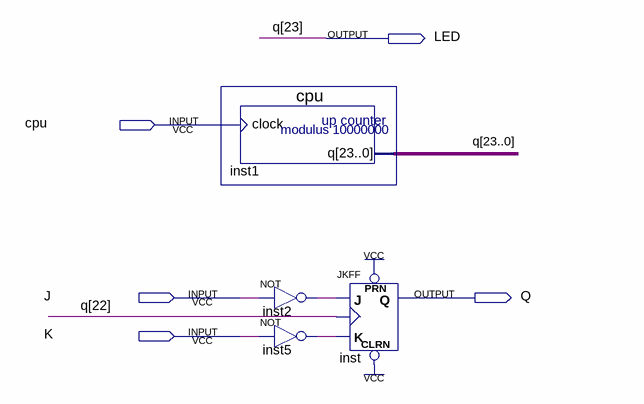
[diagram p0: schematic sheet]
// Quartus schematic jkffDe.bdf as structural Verilog: 4 symbols, 5 pins
module jkffDe (
  input  cpu,
  input  J,
  input  K,
  output LED,
  output Q
);

  wire inst2_out, inst5_out;
  wire [22:0] Q_bus;

  cpu inst1 (.clock(cpu), .q({LED, Q_bus}));
  not inst2 (inst2_out, J);
  not inst5 (inst5_out, K);
  JKFF inst (.PRN(1'b1), .CLRN(1'b1), .K(inst5_out), .J(inst2_out), .CLK(Q_bus[22]), .Q(Q));

  // Other names for the same wires on the sheet: Q[23] = LED
endmodule
